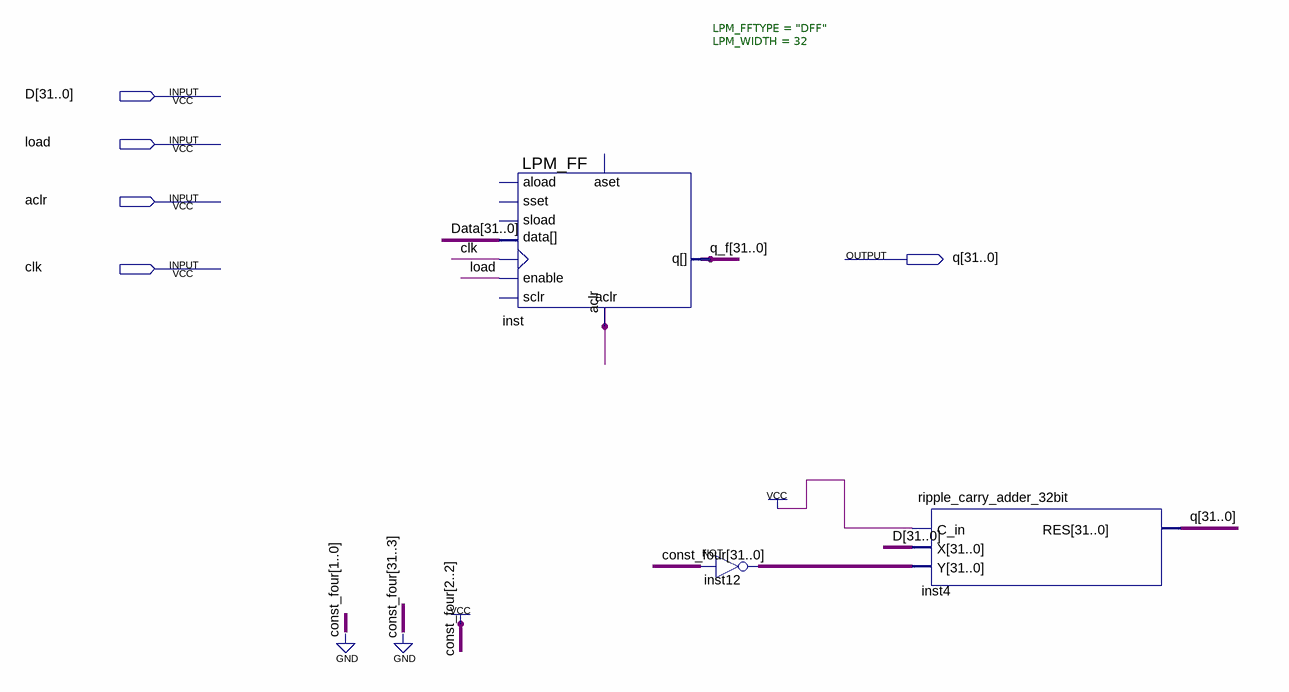
[diagram p0: schematic sheet]
// Quartus schematic r7.bdf as structural Verilog: 3 symbols, 5 pins
module r7 (
  input  [31:0] D,
  input  load,
  input  aclr,
  input  clk,
  output [31:0] q
);

  wire [31:0] const_four, Data, inst12_out, q_f;

  LPM_FF #(.LPM_FFTYPE("DFF"), .LPM_WIDTH(32)) inst (
    .enable(load), .clock(clk), .aclr(aclr), .data(Data), .q(q_f));  // open: aload, sset, sload, aset, sclr
  assign inst12_out = ~{const_four[31:3], 1'b1, const_four[1:0]};  // NOT inst12, 32 bits wide
  ripple_carry_adder_32bit inst4 (.C_in(1'b1), .X(D), .Y(inst12_out), .RES(q));
endmodule
